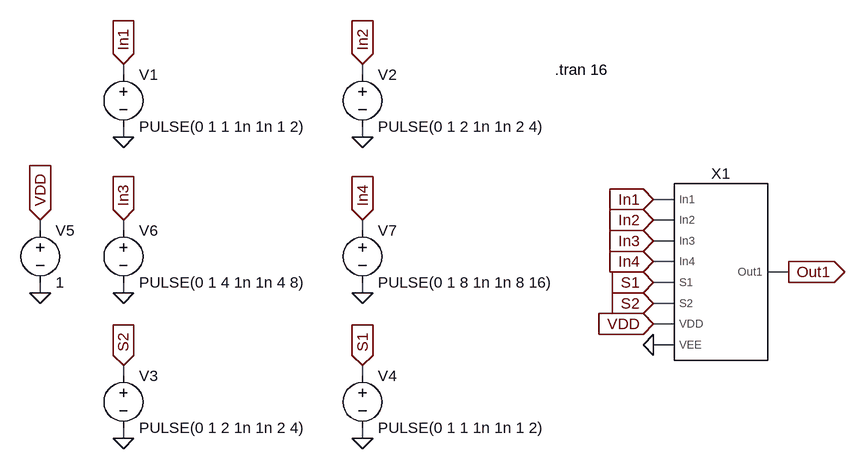
[diagram p0: schematic 4_to_1_Multiplexer_Symbol_Test.asc]
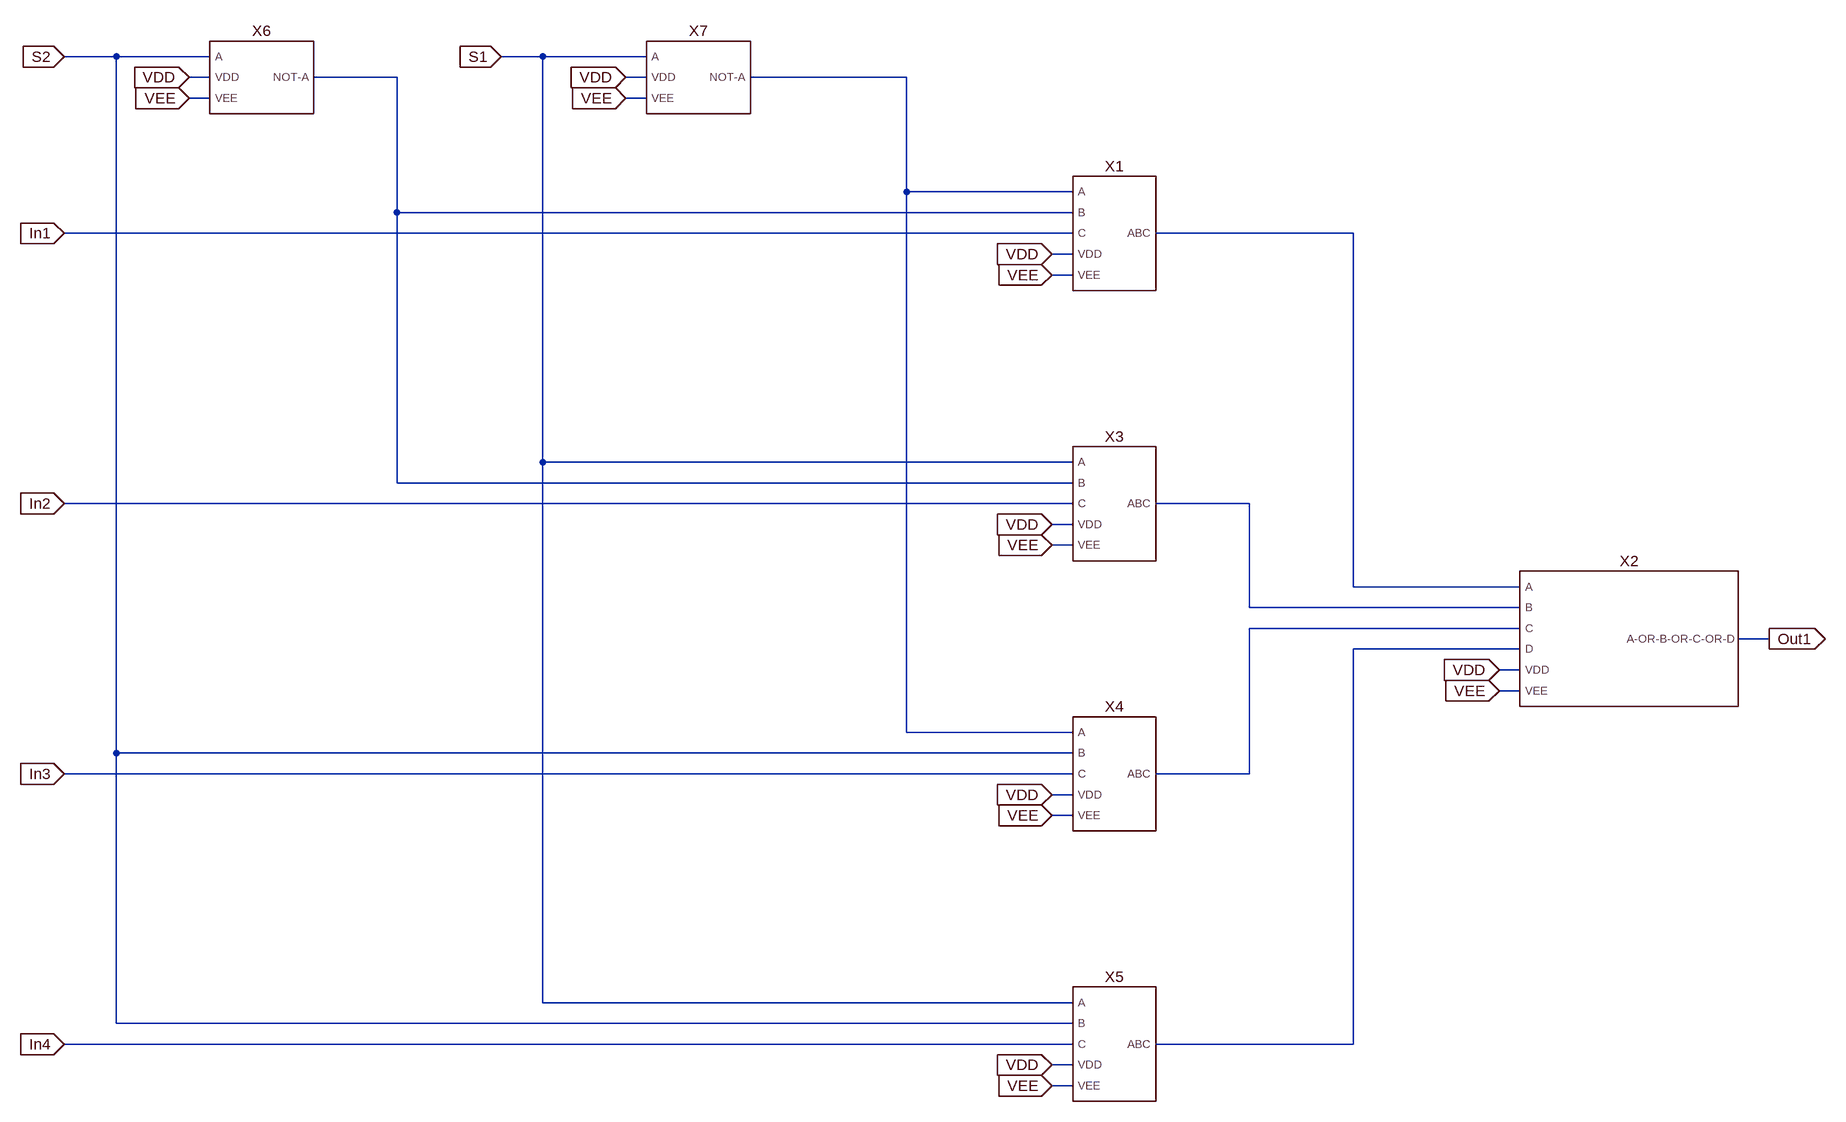
[diagram p1: sub-circuit 4_to_1_multiplexer_symbol.asc]
4_to_1_Multiplexer_Symbol_Test.asc, the LTspice schematic file:
Version 4
SHEET 1 1092 680
WIRE -32 80 -32 64
WIRE 336 80 336 64
WIRE -32 176 -32 160
WIRE 336 176 336 160
WIRE 816 272 784 272
WIRE 816 304 784 304
WIRE -160 320 -160 304
WIRE -32 320 -32 304
WIRE 336 320 336 304
WIRE 816 336 784 336
WIRE 816 368 784 368
WIRE 992 384 960 384
WIRE 816 400 784 400
WIRE -160 416 -160 400
WIRE -32 416 -32 400
WIRE 336 416 336 400
WIRE 816 432 784 432
WIRE 816 464 784 464
WIRE 816 496 784 496
WIRE -32 544 -32 528
WIRE 336 544 336 528
WIRE -32 640 -32 624
WIRE 336 640 336 624
FLAG 336 176 0
FLAG -32 176 0
FLAG -32 640 0
FLAG 336 640 0
FLAG -32 64 In1
IOPIN -32 64 In
FLAG 336 64 In2
IOPIN 336 64 In
FLAG -32 528 S2
IOPIN -32 528 In
FLAG 336 528 S1
IOPIN 336 528 In
FLAG -160 416 0
FLAG -160 304 VDD
IOPIN -160 304 In
FLAG 336 416 0
FLAG -32 416 0
FLAG -32 304 In3
IOPIN -32 304 In
FLAG 336 304 In4
IOPIN 336 304 In
FLAG 784 496 0
FLAG 784 464 VDD
IOPIN 784 464 In
FLAG 784 432 S2
IOPIN 784 432 In
FLAG 784 400 S1
IOPIN 784 400 In
FLAG 784 272 In1
IOPIN 784 272 In
FLAG 784 304 In2
IOPIN 784 304 In
FLAG 784 336 In3
IOPIN 784 336 In
FLAG 784 368 In4
IOPIN 784 368 In
FLAG 992 384 Out1
IOPIN 992 384 Out
SYMBOL 4_to_1_Multiplexer_Symbol 880 384 R0
SYMATTR InstName X1
SYMBOL Voltage -32 64 R0
SYMATTR InstName V1
SYMATTR Value PULSE(0 1 1 1n 1n 1 2)
SYMBOL Voltage 336 64 R0
SYMATTR InstName V2
SYMATTR Value PULSE(0 1 2 1n 1n 2 4)
SYMBOL Voltage -32 528 R0
SYMATTR InstName V3
SYMATTR Value PULSE(0 1 2 1n 1n 2 4)
SYMBOL Voltage 336 528 R0
SYMATTR InstName V4
SYMATTR Value PULSE(0 1 1 1n 1n 1 2)
SYMBOL Voltage -160 304 R0
SYMATTR InstName V5
SYMATTR Value 1
SYMBOL Voltage -32 304 R0
SYMATTR InstName V6
SYMATTR Value PULSE(0 1 4 1n 1n 4 8)
SYMBOL Voltage 336 304 R0
SYMATTR InstName V7
SYMATTR Value PULSE(0 1 8 1n 1n 8 16)
TEXT 632 72 Left 2 !.tran 16

4_to_1_multiplexer_symbol.asc, the sub-circuit schematic file:
Version 4
SHEET 1 1332 1692
WIRE -1312 48 -1392 48
WIRE -1168 48 -1312 48
WIRE -656 48 -720 48
WIRE -496 48 -656 48
WIRE -1168 80 -1200 80
WIRE -880 80 -1008 80
WIRE -496 80 -528 80
WIRE -96 80 -336 80
WIRE -1168 112 -1200 112
WIRE -496 112 -528 112
WIRE -96 256 -96 80
WIRE 160 256 -96 256
WIRE -880 288 -880 80
WIRE 160 288 -880 288
WIRE 160 320 -1392 320
WIRE 592 320 288 320
WIRE 160 352 128 352
WIRE 160 384 128 384
WIRE -656 672 -656 48
WIRE 160 672 -656 672
WIRE -880 704 -880 288
WIRE 160 704 -880 704
WIRE 160 736 -1392 736
WIRE 432 736 288 736
WIRE 160 768 128 768
WIRE 160 800 128 800
WIRE 592 864 592 320
WIRE 848 864 592 864
WIRE 432 896 432 736
WIRE 848 896 432 896
WIRE 848 928 432 928
WIRE 1232 944 1184 944
WIRE 848 960 592 960
WIRE 848 992 816 992
WIRE 848 1024 816 1024
WIRE -96 1088 -96 256
WIRE 160 1088 -96 1088
WIRE -1312 1120 -1312 48
WIRE 160 1120 -1312 1120
WIRE 160 1152 -1392 1152
WIRE 432 1152 432 928
WIRE 432 1152 288 1152
WIRE 160 1184 128 1184
WIRE 160 1216 128 1216
WIRE -656 1504 -656 672
WIRE 160 1504 -656 1504
WIRE -1312 1536 -1312 1120
WIRE 160 1536 -1312 1536
WIRE 160 1568 -1392 1568
WIRE 592 1568 592 960
WIRE 592 1568 288 1568
WIRE 160 1600 128 1600
WIRE 160 1632 128 1632
FLAG -1200 80 VDD
IOPIN -1200 80 In
FLAG -528 80 VDD
IOPIN -528 80 In
FLAG 128 352 VDD
IOPIN 128 352 In
FLAG 128 768 VDD
IOPIN 128 768 In
FLAG 128 1184 VDD
IOPIN 128 1184 In
FLAG 128 1600 VDD
IOPIN 128 1600 In
FLAG 816 992 VDD
IOPIN 816 992 In
FLAG -720 48 S1
IOPIN -720 48 In
FLAG -1392 48 S2
IOPIN -1392 48 In
FLAG -1392 320 In1
IOPIN -1392 320 In
FLAG -1392 736 In2
IOPIN -1392 736 In
FLAG -1392 1152 In3
IOPIN -1392 1152 In
FLAG -1392 1568 In4
IOPIN -1392 1568 In
FLAG 1232 944 Out1
IOPIN 1232 944 Out
FLAG -1200 112 VEE
IOPIN -1200 112 In
FLAG -528 112 VEE
IOPIN -528 112 In
FLAG 128 384 VEE
IOPIN 128 384 In
FLAG 128 800 VEE
IOPIN 128 800 In
FLAG 128 1216 VEE
IOPIN 128 1216 In
FLAG 128 1632 VEE
IOPIN 128 1632 In
FLAG 816 1024 VEE
IOPIN 816 1024 In
SYMBOL 3_Input_AND_Gate_Symbol 224 320 R0
SYMATTR InstName X1
SYMBOL 4_Input_OR_Gate_Symbol 1008 944 R0
SYMATTR InstName X2
SYMBOL 3_Input_AND_Gate_Symbol 224 736 R0
SYMATTR InstName X3
SYMBOL 3_Input_AND_Gate_Symbol 224 1152 R0
SYMATTR InstName X4
SYMBOL 3_Input_AND_Gate_Symbol 224 1568 R0
SYMATTR InstName X5
SYMBOL Inverter_Gate_Symbol -1088 80 R0
SYMATTR InstName X6
SYMBOL Inverter_Gate_Symbol -416 80 R0
SYMATTR InstName X7

The netlist it stands for:
* 4_to_1_Multiplexer_Symbol_Test.asc
XX1 In1 In2 In3 In4 S1 S2 VDD 0 Out1 4_to_1_multiplexer_symbol
V1 In1 0 PULSE(0 1 1 1n 1n 1 2)
V2 In2 0 PULSE(0 1 2 1n 1n 2 4)
V3 S2 0 PULSE(0 1 2 1n 1n 2 4)
V4 S1 0 PULSE(0 1 1 1n 1n 1 2)
V5 VDD 0 1
V6 In3 0 PULSE(0 1 4 1n 1n 4 8)
V7 In4 0 PULSE(0 1 8 1n 1n 8 16)

* block symbol definitions
.subckt 4_to_1_multiplexer_symbol In1 In2 In3 In4 S1 S2 VDD VEE Out1
XX1 N002 N001 In1 VDD VEE N003 3_Input_AND_Gate_Symbol  ; pins A B C VDD VEE ABC
XX2 N003 N004 N005 N006 VDD VEE Out1 4_Input_OR_Gate_Symbol  ; pins A B C D VDD VEE A-OR-B-OR-C-OR-D
XX3 S1 N001 In2 VDD VEE N004 3_Input_AND_Gate_Symbol  ; pins A B C VDD VEE ABC
XX4 N002 S2 In3 VDD VEE N005 3_Input_AND_Gate_Symbol  ; pins A B C VDD VEE ABC
XX5 S1 S2 In4 VDD VEE N006 3_Input_AND_Gate_Symbol  ; pins A B C VDD VEE ABC
XX6 S2 VDD VEE N001 Inverter_Gate_Symbol  ; pins A VDD VEE NOT-A
XX7 S1 VDD VEE N002 Inverter_Gate_Symbol  ; pins A VDD VEE NOT-A
.ends 4_to_1_multiplexer_symbol

.tran 16
.backanno
.end